# EAGLE schematic tick-display-mk-5 (EAGLE 6.5.0)
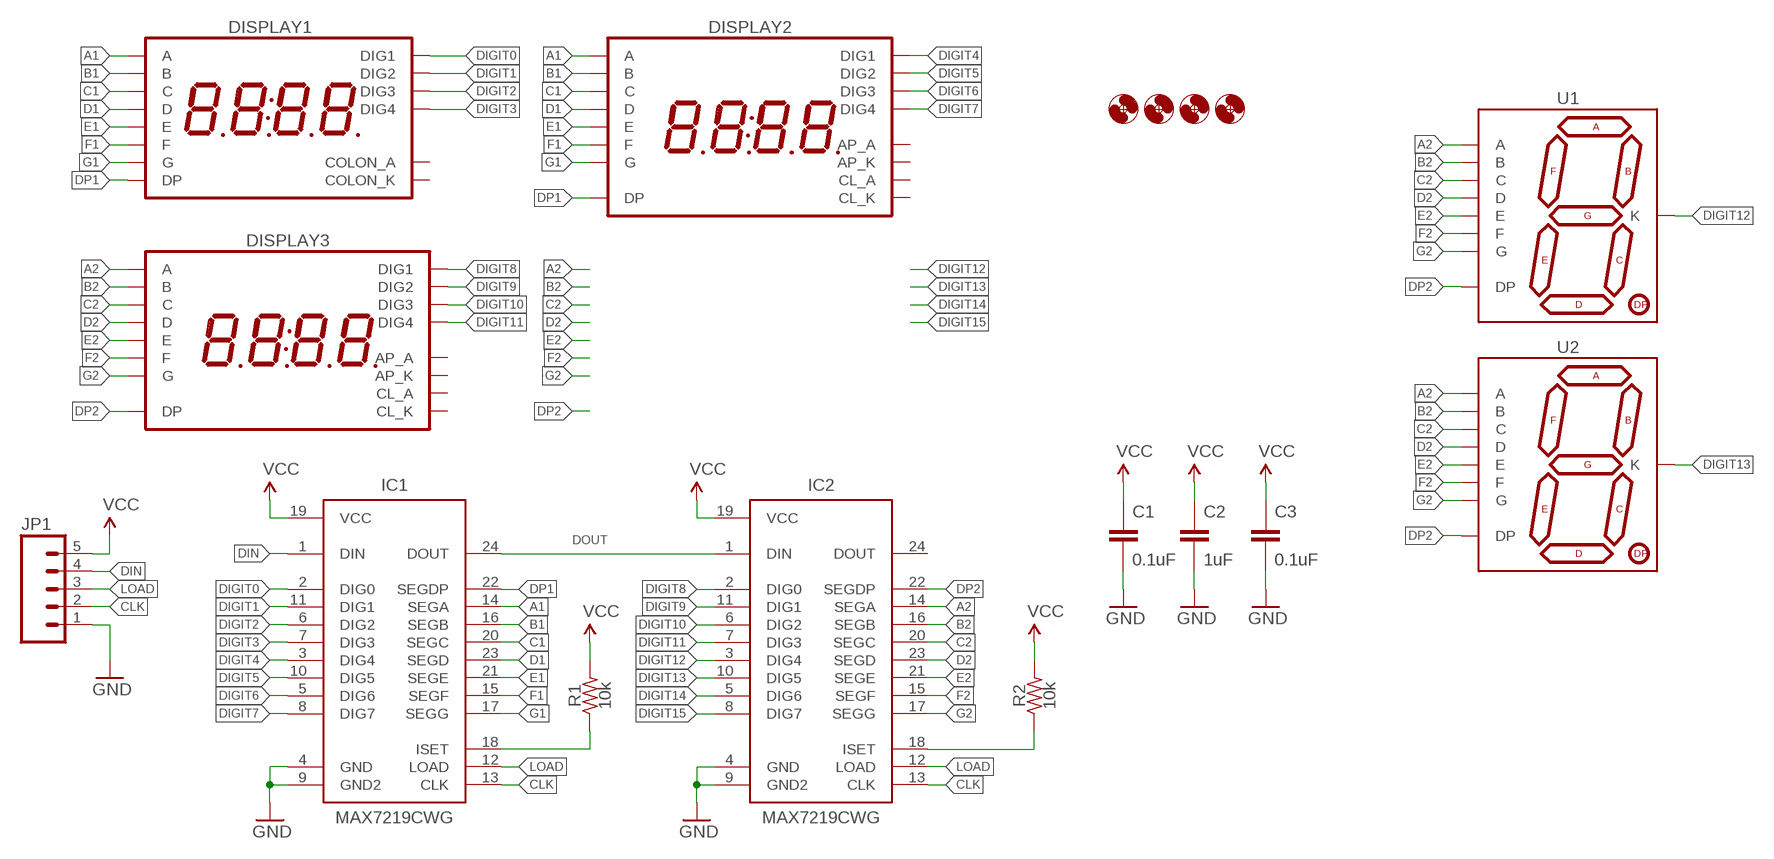
[diagram p0: schematic, sheet 1]

## Parts
C1  0.1uF  CAPACITOR-CERAMIC025-024X044  [C025-024X044]
C2  1uF  CAPACITOR-CERAMIC025-024X044  [C025-024X044]
C3  0.1uF  CAPACITOR-CERAMIC025-024X044  [C025-024X044]
DISPLAY1  7SEG_4DIGIT_COLON14.2MM-CC  [7SEG_4DIG_0.56IN_14MM_ADAFRUIT]
DISPLAY2  7SEG_4DIGIT_COLON_APOS  [7SEG_4DIG_10MM]
DISPLAY3  7SEG_4DIGIT_COLON_APOS  [7SEG_4DIG_10MM]
H1  HOLE#2  [HOLE-#2]
H2  HOLE#2  [HOLE-#2]
H3  HOLE#2  [HOLE-#2]
H4  HOLE#2  [HOLE-#2]
IC1  MAX7219CWG  MAX7219SOIC-W  [SO24W]
IC2  MAX7219CWG  MAX7219SOIC-W  [SO24W]
JP1  M05JST-PH-VERT-PTH  [JST-5-PH-VERT-PTH]
R1  10k  RESISTORPTH-AXIAL-5.08MM  [RESISTOR-AXIAL-PTH-5.08MM]
R2  10k  RESISTORPTH-AXIAL-5.08MM  [RESISTOR-AXIAL-PTH-5.08MM]
U1  7SEG_1DIGPTH-10MM  [7SEG_1DIG_10MM]
U2  7SEG_1DIGPTH-10MM  [7SEG_1DIG_10MM]

## Nets
A1: DISPLAY1.P$13(A) DISPLAY2.14(A) IC1.14(SEGA)
A2: DISPLAY3.14(A) IC2.14(SEGA) U1.10(A) U2.10(A)
B1: DISPLAY1.P$9(B) DISPLAY2.16(B) IC1.16(SEGB)
B2: DISPLAY3.16(B) IC2.16(SEGB) U1.9(B) U2.9(B)
C1: DISPLAY1.P$4(C) DISPLAY2.13(C) IC1.20(SEGC)
C2: DISPLAY3.13(C) IC2.20(SEGC) U1.8(C) U2.8(C)
CLK: IC1.13(CLK) IC2.13(CLK) JP1.2
D1: DISPLAY1.P$2(D) DISPLAY2.3(D) IC1.23(SEGD)
D2: DISPLAY3.3(D) IC2.23(SEGD) U1.5(D) U2.5(D)
DIGIT0: DISPLAY1.P$14(DIG1) IC1.2(DIG0)
DIGIT1: DISPLAY1.P$11(DIG2) IC1.11(DIG1)
DIGIT2: DISPLAY1.P$10(DIG3) IC1.6(DIG2)
DIGIT3: DISPLAY1.P$6(DIG4) IC1.7(DIG3)
DIGIT4: DISPLAY2.1(DIG1) IC1.3(DIG4)
DIGIT5: DISPLAY2.2(DIG2) IC1.10(DIG5)
DIGIT6: DISPLAY2.6(DIG3) IC1.5(DIG6)
DIGIT7: DISPLAY2.8(DIG4) IC1.8(DIG7)
DIGIT8: DISPLAY3.1(DIG1) IC2.2(DIG0)
DIGIT9: DISPLAY3.2(DIG2) IC2.11(DIG1)
DIGIT10: DISPLAY3.6(DIG3) IC2.6(DIG2)
DIGIT11: DISPLAY3.8(DIG4) IC2.7(DIG3)
DIGIT12: IC2.3(DIG4) U1.1(K) U1.6(K)
DIGIT13: IC2.10(DIG5) U2.1(K) U2.6(K)
DIGIT14: IC2.5(DIG6)
DIGIT15: IC2.8(DIG7)
DIN: IC1.1(DIN) JP1.4
DOUT: IC1.24(DOUT) IC2.1(DIN)
DP1: DISPLAY1.P$3(DP) DISPLAY2.7(DP) IC1.22(SEGDP)
DP2: DISPLAY3.7(DP) IC2.22(SEGDP) U1.7(DP) U2.7(DP)
E1: DISPLAY1.P$1(E) DISPLAY2.5(E) IC1.21(SEGE)
E2: DISPLAY3.5(E) IC2.21(SEGE) U1.4(E) U2.4(E)
F1: DISPLAY1.P$12(F) DISPLAY2.11(F) IC1.15(SEGF)
F2: DISPLAY3.11(F) IC2.15(SEGF) U1.2(F) U2.2(F)
G1: DISPLAY1.P$5(G) DISPLAY2.15(G) IC1.17(SEGG)
G2: DISPLAY3.15(G) IC2.17(SEGG) U1.3(G) U2.3(G)
GND: C1.2 C2.2 C3.2 IC1.4(GND) IC1.9(GND2) IC2.4(GND) IC2.9(GND2) JP1.1
LOAD: IC1.12(LOAD) IC2.12(LOAD) JP1.3
N$2: IC1.18(ISET) R1.P$1
N$13: IC2.18(ISET) R2.P$1
VCC: C1.1 C2.1 C3.1 IC1.19(VCC) IC2.19(VCC) JP1.5 R1.P$2 R2.P$2
Unconnected: DISPLAY1.P$7(COLON_K) DISPLAY1.P$8(COLON_A) DISPLAY2.4(CL_A) DISPLAY2.9(AP_K) DISPLAY2.10(AP_A) DISPLAY2.12(CL_K) DISPLAY3.4(CL_A) DISPLAY3.9(AP_K) DISPLAY3.10(AP_A) DISPLAY3.12(CL_K) IC2.24(DOUT)

## Library data of the parts
C1-C3 = A_butts:CAPACITOR-CERAMIC: CAPACITOR, European symbol
DISPLAY1 = A_butts:7SEG_4DIGIT_COLON
DISPLAY2 DISPLAY3 = A_butts:7SEG_4DIGIT_COLON_APOS
H1-H4 = A_butts:HOLE: MOUNTING HOLE with drill center marker
IC1 IC2 = A_butts:MAX7219: 8-digit, 8-segment LED display driver, serial input
JP1 = A_butts:M05: Header 5 Standard 5-pin 0.1" header. Use with straight break away headers (SKU : PRT-00116), right angle break away headers (PRT-00553), swiss pins (PRT-00743), machine pins (PRT-00117), and female headers (PRT-00115). Molex polarized connector foot print use with SKU : PRT-08230 with associated crimp pins and housings.
R1 R2 = A_butts:RESISTOR: RESISTOR, American symbol
U1 U2 = A_butts:7SEG_1DIG